# Altium schematic sheet 780-00036, rev3, Sch, Crate Slot Power Interface.SchDoc
size B; PageSetup: Record=PageOptions|CenterHorizontal=True|CenterVertical=True|PrintScale=1.09|XCorrection=1.00|YCorrection=1.00|PrintKind=0|BorderSize=5000000|LeftOffset=0|BottomOffset=0|Orientation=2|PaperLength=1000|PaperWidth=1000|Scale=100|PaperSource=7|PrintQuality=-4|MediaType=1|DitherType=10|PaperKind=Tabloid|PrintScaleMode=1
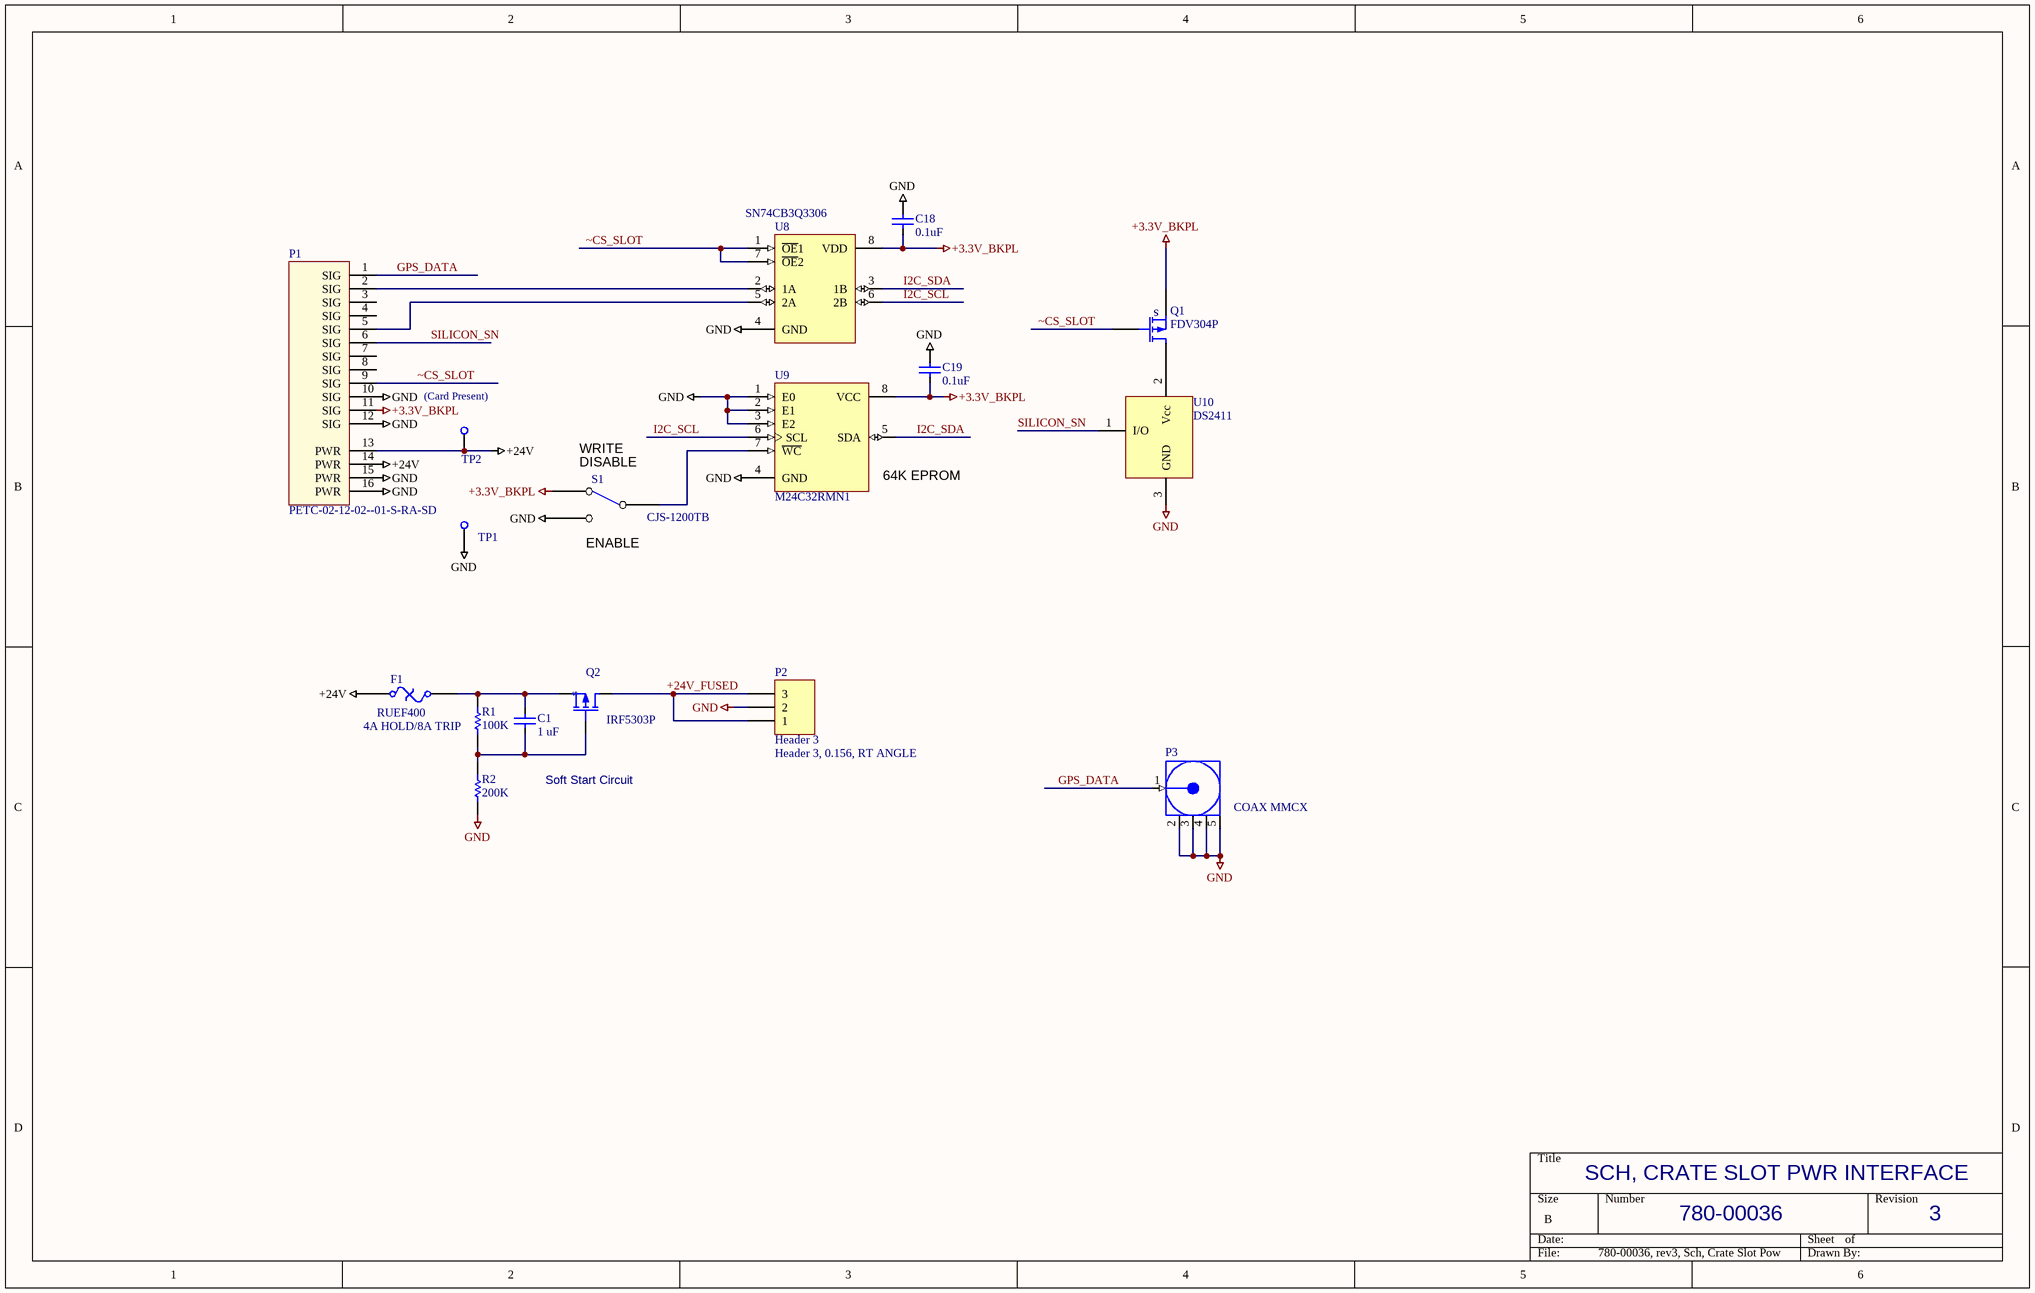
[diagram p0: 780-00036, rev3, Sch, Crate Slot Power Interface.SchDoc]

## Parts
C1  value 1 uF  [SMD_0805]  (hidden comment: Cap SMD)
C18  value 0.1uF  [SMD_0805]  (hidden comment: Cap SMD)
C19  value 0.1uF  [SMD_0805]  (hidden comment: Cap SMD)
F1  RUEF400  value 4A HOLD/8A TRIP  [PolySwitch Radial 0.2]
P1  PETC-02-12-02--01-S-RA-SD  [PETC-02-12-02-01-RA]
P2  Header 3  value Header 3, 0.156, RT ANGLE  [HDR 1X3 0.156" - RT ANGLE]
P3  COAX MMCX  [MMCX2.54-V5]
Q1  FDV304P  [SMD_SOT23_3]
Q2  IRF5303P  [TO-252(D-PAK)  PowerPAD]
R1  value 100K  [SMD_0805]  (hidden comment: Res 0805)
R2  value 200K  [SMD_0805]  (hidden comment: Res 0805)
S1  CJS-1200TB  [CAS-120B]
TP1  Test Point SMD  [SMD_TEST POINT]  (value not drawn)
TP2  Test Point SMD  [SMD_TEST POINT]  (value not drawn)
U8  value SN74CB3Q3306  [PW008_N]  (hidden comment: SN74CBT3306PWLE)
U9  M24C32RMN1  [SOP8_N]
U10  DS2411  [SMD_SOT23_3]

## Nets
+3.3V_BKPL: C18.1 C19.1 P1.11(SIG) Q1.2(S) S1.3(NC) U8.8(VDD) U9.8(VCC)
+24V: F1.1 P1.13(PWR) P1.14(PWR) TP2.1(TP)
GND: C18.2 C19.2 P1.10(SIG) P1.12(SIG) P1.15(PWR) P1.16(PWR) P2.2 P3.2(GND) P3.3(GND) P3.4(GND) P3.5(GND) R2.1 S1.1(NO) TP1.1(TP) U8.4(GND) U9.1(E0) U9.2(E1) U9.3(E2) U9.4(GND) U10.3(GND)
+24V_FUSED: P2.1 P2.3 Q2.2(D)
GPS_DATA: P1.1(SIG) P3.1(Signal)
I2C_SCL: U8.6(2B) U9.6(SCL)
I2C_SDA: U8.3(1B) U9.5(SDA)
SILICON_SN: P1.6(SIG) U10.1(I/O)
~CS_SLOT: P1.9(SIG) Q1.1(G) U8.1(~{OE}1) U8.7(~{OE}2)
NetC1_1: C1.1 Q2.1(G) R1.1 R2.2
NetC1_2: C1.2 F1.2 Q2.3(S) R1.2
NetP1_2: P1.2(SIG) U8.2(1A)
NetP1_5: P1.5(SIG) U8.5(2A)
NetQ1_3: Q1.3(D) U10.2(Vcc)
NetS1_2: S1.2(COM) U9.7(~{WC})

Not connected (* = marked no-connect by the designer): P1 3(SIG) 4(SIG) 7(SIG) 8(SIG)

## Notes on the sheet
- (near TP2) (Card Present)
- (near S1) WRITE
- (near S1) DISABLE
- (near U9) 64K EPROM
- (near S1) ENABLE
- Soft Start Circuit
- SCH, CRATE SLOT PWR INTERFACE
- 780-00036
- 3
- (in symbol FDV304P) s
- (in symbol IRF5303P) s

## Library data of the parts
C1 = Cap SMD: Capacitor; LCO p/n: 120-00006
C18 C19 = Cap SMD: Capacitor; Manufacturer: AVX; Manuf p/n: 08055C104KAT2A; Vendor: DigiKey; Vendor p/n: 478-1395-1-ND; Vendor Mult.: 10; LCO P/N: 120-00002; COST: 0.088
F1 = Fuse Thermal: PolySwitch RUE Series; Manufacturer: Tyco Electronics; Vendor: DIGIKEY; Vendor Mult.: 1; Vendor p/n: RUEF400-ND; LCO p/n: 145-00003; COST: 0.50; Manuf p/n: RUEF400
P1 = PETC-02-12-02--01-S-RA-SD: SAMTEC, SIGNAL(12)+PWR(4); LCO p/n: 125-00087; Vendor Mult.: 1; Manufacturer: SAMTEC; Manuf p/n: PETC-02-12-02--01-S-RA-SD; Vendor: SAMTEC; Vendor p/n: PETC-02-12-02--01-S-RA-SD
P2 = Header 3, 0.156 RT ANGLE: Header, 3-Pin, 0.156, RT ANGLE; Manufacturer: TE Connectivity; Manuf p/n: 640389-3; Vendor: Digi-Key; Vendor p/n: A19920-ND; Vendor Mult.: 1; LCO p/n: 125-00104
P3 = COAX-M: RF Coaxial PCB Connector, MMCX; Thru-Hole, Vertical Mount Plug,  50 Ohm Impedance; Manufacturer: Emerson; Manuf p/n: 135-3701-201; Vendor: DigiKey; Vendor p/n: J597-ND; VALUE: COAX-M; Vendor Mult.: 1; LCO p/n: 125-00054; COST: 5.24
Q1 = FDV304P: P-MOSFET LOGIC LEVEL; Manufacturer: Fairchild; Vendor: DigiKey; Vendor p/n: FDV304PCT-ND; Vendor Mult.: 1; LCO P/N: 195-00004; COST: 0.46; Manuf p/n: FDV304P; Value: FDV304P
Q2 = IRF5303P: P-Chan MOSFET; Manufacturer: INT'l Rectifier; Manuf p/n: IRFR5305TRPBF; LCO p/n: 150-00093; Vendor: Digi-Key; Vendor Mult.: 1; Vendor p/n: IRFR5305PBFCT-ND; VALUE: IRF5303P
R1 = Res SMD: Resistor 0805; Manufacturer: Vishay/Dale; Manuf p/n: CRCW0805100KFKEA; Vendor: DIGIKEY; Vendor p/n: 541-100KCCT-ND; Vendor Mult.: 10; LCO p/n: 181-01003; COST: 0.09
R2 = Res SMD: Resistor 0805; Manufacturer: Vishay/Dale; Manuf p/n: CRCW0805200KFKEA; Vendor: DIGIKEY; Vendor p/n: 541-200KCCT-ND; Vendor Mult.: 10; LCO p/n: 181-02003; COST: 0.09
S1 = SW_SPDT_DOUG: Manufacturer: Copal Electronics; Manuf p/n: CAS-120TB; Vendor: DIGIKEY; Vendor Mult.: 1; LCO p/n: 185-00010; COST: 1.27; Value: SW_SPDT
TP1 TP2 = Test Point SMD: SMD loop test point; LCO p/n: 160-00001; VALUE: Test Point SMD
U8 = SN74CBT3306PWLE: Dual FET Bus Switch; Manufacturer: TI; Manuf p/n: SN74CB3Q3306APWR; LCO p/n: 150-00083; Vendor: Digi-Key; Vendor Mult.: 1; Vendor p/n: 296-15102-1-ND; COST: 0.95
U9 = M24C32RMN1: 32 Kbit Serial I²C Bus EEPROM; LCO p/n: 150-00076
U10 = DS2411: Silicon Serial Number; Manufacturer: MAXIM; Manuf p/n: DS2411R+T&R; Vendor: DIGIKEY; Vendor p/n: DS2411R+CT-ND; Vendor Mult.: 1; LCO p/n: 150-00031; COST: 1.25; VALUE: DS2411